# Altium schematic sheet GNSS_B.SchDoc
size A; SheetNumber: 4; SheetTotal: 7
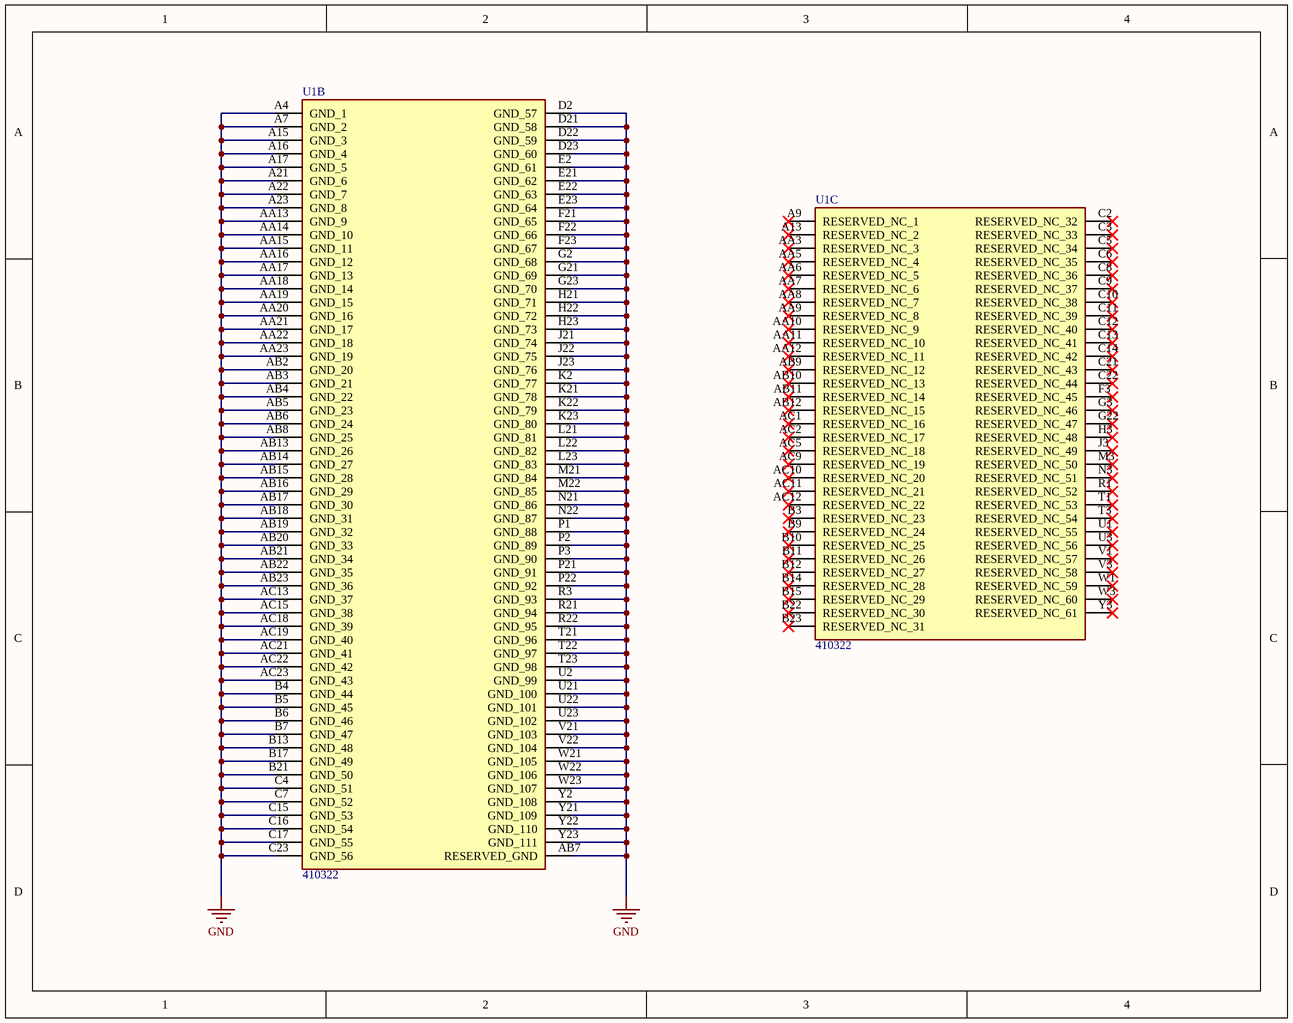
[diagram p0: GNSS_B.SchDoc]

## Parts
U1  410322  [LGA239C127P23X23_3100X3100X417N]  (parts B,C of 3)

## Nets
GND: U1.A4(GND_1) U1.A7(GND_2) U1.A15(GND_3) U1.A16(GND_4) U1.A17(GND_5) U1.A21(GND_6) U1.A22(GND_7) U1.A23(GND_8) U1.AA13(GND_9) U1.AA14(GND_10) U1.AA15(GND_11) U1.AA16(GND_12) U1.AA17(GND_13) U1.AA18(GND_14) U1.AA19(GND_15) U1.AA20(GND_16) U1.AA21(GND_17) U1.AA22(GND_18) U1.AA23(GND_19) U1.AB2(GND_20) U1.AB3(GND_21) U1.AB4(GND_22) U1.AB5(GND_23) U1.AB6(GND_24) U1.AB7(RESERVED_GND) U1.AB8(GND_25) U1.AB13(GND_26) U1.AB14(GND_27) U1.AB15(GND_28) U1.AB16(GND_29) U1.AB17(GND_30) U1.AB18(GND_31) U1.AB19(GND_32) U1.AB20(GND_33) U1.AB21(GND_34) U1.AB22(GND_35) U1.AB23(GND_36) U1.AC13(GND_37) U1.AC15(GND_38) U1.AC18(GND_39) U1.AC19(GND_40) U1.AC21(GND_41) U1.AC22(GND_42) U1.AC23(GND_43) U1.B4(GND_44) U1.B5(GND_45) U1.B6(GND_46) U1.B7(GND_47) U1.B13(GND_48) U1.B17(GND_49) U1.B21(GND_50) U1.C4(GND_51) U1.C7(GND_52) U1.C15(GND_53) U1.C16(GND_54) U1.C17(GND_55) U1.C23(GND_56) U1.D2(GND_57) U1.D21(GND_58) U1.D22(GND_59) U1.D23(GND_60) U1.E2(GND_61) U1.E21(GND_62) U1.E22(GND_63) U1.E23(GND_64) U1.F21(GND_65) U1.F22(GND_66) U1.F23(GND_67) U1.G2(GND_68) U1.G21(GND_69) U1.G23(GND_70) U1.H21(GND_71) U1.H22(GND_72) U1.H23(GND_73) U1.J21(GND_74) U1.J22(GND_75) U1.J23(GND_76) U1.K2(GND_77) U1.K21(GND_78) U1.K22(GND_79) U1.K23(GND_80) U1.L21(GND_81) U1.L22(GND_82) U1.L23(GND_83) U1.M21(GND_84) U1.M22(GND_85) U1.N21(GND_86) U1.N22(GND_87) U1.P1(GND_88) U1.P2(GND_89) U1.P3(GND_90) U1.P21(GND_91) U1.P22(GND_92) U1.R3(GND_93) U1.R21(GND_94) U1.R22(GND_95) U1.T21(GND_96) U1.T22(GND_97) U1.T23(GND_98) U1.U2(GND_99) U1.U21(GND_100) U1.U22(GND_101) U1.U23(GND_102) U1.V21(GND_103) U1.V22(GND_104) U1.W21(GND_105) U1.W22(GND_106) U1.W23(GND_107) U1.Y2(GND_108) U1.Y21(GND_109) U1.Y22(GND_110) U1.Y23(GND_111)

Not connected (* = marked no-connect by the designer): U1 A9(RESERVED_NC_1)* A13(RESERVED_NC_2)* AA3(RESERVED_NC_3)* AA5(RESERVED_NC_4)* AA6(RESERVED_NC_5)* AA7(RESERVED_NC_6)* AA8(RESERVED_NC_7)* AA9(RESERVED_NC_8)* AA10(RESERVED_NC_9)* AA11(RESERVED_NC_10)* AA12(RESERVED_NC_11)* AB9(RESERVED_NC_12)* AB10(RESERVED_NC_13)* AB11(RESERVED_NC_14)* AB12(RESERVED_NC_15)* AC1(RESERVED_NC_16)* AC2(RESERVED_NC_17)* AC5(RESERVED_NC_18)* AC9(RESERVED_NC_19)* AC10(RESERVED_NC_20)* AC11(RESERVED_NC_21)* AC12(RESERVED_NC_22)* B3(RESERVED_NC_23)* B9(RESERVED_NC_24)* B10(RESERVED_NC_25)* B11(RESERVED_NC_26)* B12(RESERVED_NC_27)* B14(RESERVED_NC_28)* B15(RESERVED_NC_29)* B22(RESERVED_NC_30)* B23(RESERVED_NC_31)* C2(RESERVED_NC_32)* C3(RESERVED_NC_33)* C5(RESERVED_NC_34)* C6(RESERVED_NC_35)* C8(RESERVED_NC_36)* C9(RESERVED_NC_37)* C10(RESERVED_NC_38)* C11(RESERVED_NC_39)* C12(RESERVED_NC_40)* C13(RESERVED_NC_41)* C14(RESERVED_NC_42)* C21(RESERVED_NC_43)* C22(RESERVED_NC_44)* F3(RESERVED_NC_45)* G3(RESERVED_NC_46)* G22(RESERVED_NC_47)* H3(RESERVED_NC_48)* J3(RESERVED_NC_49)* M3(RESERVED_NC_50)* N3(RESERVED_NC_51)* R1(RESERVED_NC_52)* T1(RESERVED_NC_53)* T3(RESERVED_NC_54)* U1(RESERVED_NC_55)* U3(RESERVED_NC_56)* V1(RESERVED_NC_57)* V3(RESERVED_NC_58)* W1(RESERVED_NC_59)* W3(RESERVED_NC_60)* Y3(RESERVED_NC_61)*

## Library data of the parts
U1 = 410322: mosaicâ„¢-X5 RF Receiver BeiDou, Galileo, GLONASS, GNSS, GPS; MF: Septentrio Inc.; Value: *; Check_prices: https://www.snapeda.com/parts/410322/ept/view-part/?ref=eda; Purchase-URL: https://pricing.snapeda.com/search/part/410322/?ref=eda; Price: None; MP: 410322; SnapEDA_Link: https://www.snapeda.com/parts/410322/ept/view-part/?ref=snap; Availability: In Stock; Package: None